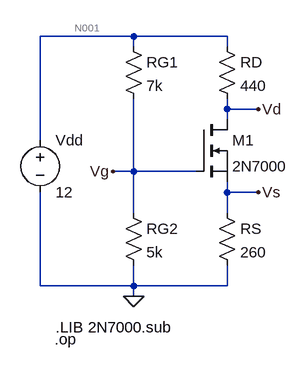
[diagram p0: schematic PreLab2.asc]
PreLab2.asc, the LTspice schematic file:
Version 4
SHEET 1 880 680
WIRE 96 32 -48 32
WIRE 240 32 96 32
WIRE 96 48 96 32
WIRE 240 48 240 32
WIRE 240 144 240 128
WIRE 288 144 240 144
WIRE 240 160 240 144
WIRE -48 192 -48 32
WIRE 96 240 96 128
WIRE 96 240 64 240
WIRE 192 240 96 240
WIRE 240 272 240 256
WIRE 288 272 240 272
WIRE 96 304 96 240
WIRE 240 304 240 272
WIRE -48 416 -48 272
WIRE 96 416 96 384
WIRE 96 416 -48 416
WIRE 240 416 240 384
WIRE 240 416 96 416
WIRE 96 432 96 416
FLAG 288 144 Vd
FLAG 288 272 Vs
FLAG 64 240 Vg
FLAG 96 432 0
SYMBOL res 80 32 R0
SYMATTR InstName RG1
SYMATTR Value 7k
SYMBOL res 80 288 R0
SYMATTR InstName RG2
SYMATTR Value 5k
SYMBOL res 224 32 R0
SYMATTR InstName RD
SYMATTR Value 440
SYMBOL res 224 288 R0
SYMATTR InstName RS
SYMATTR Value 260
SYMBOL nmos 192 160 R0
SYMATTR InstName M1
SYMATTR Value 2N7000
SYMBOL voltage -48 176 R0
WINDOW 123 0 0 Left 0
WINDOW 39 0 0 Left 0
SYMATTR InstName Vdd
SYMATTR Value 12
TEXT -26 498 Left 2 !.op
TEXT -24 480 Left 2 !.LIB 2N7000.sub

The netlist it stands for:
* PreLab2.asc
RG1 N001 Vg 7k
RG2 Vg 0 5k
RD N001 Vd 440
RS Vs 0 260
M1 Vd Vg Vs Vs 2N7000
Vdd N001 0 12
.model NMOS NMOS
.model PMOS PMOS
.lib standard.mos
.op
.LIB 2N7000.sub
.backanno
.end

* Results of the author's LTspice run, read from the files saved beside the schematic
* Operating Point:
*   V(n001) = 12 V
*   V(vg) = 5 V
*   V(vd) = 7.567 V
*   V(vs) = 2.62 V
*   Id(M1) = 10.08 mA
*   Ig(M1) = 0 A
*   Ib(M1) = -4.958 pA
*   Is(M1) = -10.08 mA
*   I(Rs) = 10.08 mA
*   I(Rd) = 10.08 mA
*   I(Rg2) = 1 mA
*   I(Rg1) = 1 mA
*   I(Vdd) = -11.08 mA
* From the log:
*   Semiconductor Device Operating Points:
*                           --- MOSFET Transistors ---
*   Name:          m1
*   Model:       2n7000
*   Id:          1.01e-02
*   Vgs:         2.38e+00
*   Vds:         4.95e+00
*   Vbs:         0.00e+00
*   Vth:         1.93e+00
*   Vdsat:       4.32e-01
*   Gm:          4.11e-02
*   Gds:         1.39e-04
*   Gmb:         7.23e-03
*   Cbd:         0.00e+00
*   Cbs:         0.00e+00
*   Cgsov:       7.27e-11
*   Cgdov:       2.54e-11
*   Cgbov:       0.00e+00
*   Cgs:         4.60e-12
*   Cgd:         0.00e+00
*   Cgb:         0.00e+00